# EAGLE design usbcan_20190426 (EAGLE 9.6.2)

## Sheet 1 of 2
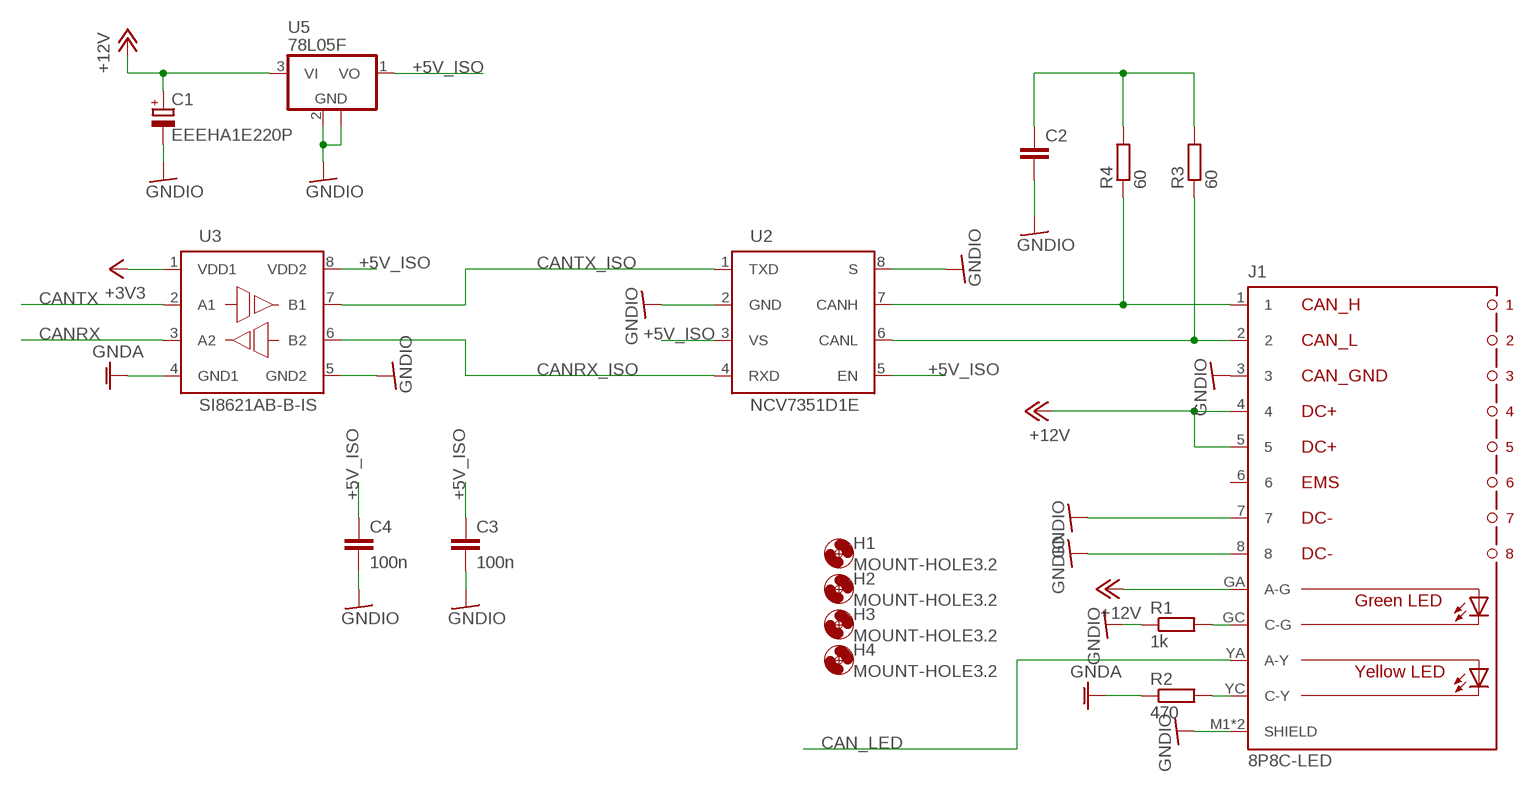
[diagram p0: schematic, sheet 1]

### Parts
C1  EEEHA1E220P  CPOL-EU153CLV-0605  [153CLV-0605]
C2  C-EUC0603  [C0603]
C3  100n  C-EUC0603  [C0603]
C4  100n  C-EUC0603  [C0603]
H1  MOUNT-HOLE3.2  [3,2]
H2  MOUNT-HOLE3.2  [3,2]
H3  MOUNT-HOLE3.2  [3,2]
H4  MOUNT-HOLE3.2  [3,2]
J1  8P8C-LED  [8P8C-LED]
R1  1k  R-EU_R0603  [R0603]
R2  470  R-EU_R0603  [R0603]
R3  60  R-EU_R0603  [R0603]
R4  60  R-EU_R0603  [R0603]
U2  NCV7351D1E  [SO08]
U3  SI8621AB-B-IS  [SO08]
U5  78L05F  [SOT89]

### Nets
+3V3: U3.1(VDD1) ; also sheet 2
+5V_ISO: C3.1 C4.1 U2.3(VS) U2.5(EN) U3.8(VDD2) U5.1(VO)
+12V: C1.+ J1.4 J1.5 J1.GA(A-G) U5.3(VI)
CAN_LED: J1.YA(A-Y) ; also sheet 2
CANH: J1.1 R4.1 U2.7(CANH)
CANL: J1.2 R3.1 U2.6(CANL)
CANRX: U3.3(A2) ; also sheet 2
CANRX_ISO: U2.4(RXD) U3.6(B2)
CANTX: U3.2(A1) ; also sheet 2
CANTX_ISO: U2.1(TXD) U3.7(B1)
GNDA: R2.1 U3.4(GND1) ; also sheet 2
GNDIO: C1.- C2.2 C3.2 C4.2 J1.3 J1.7 J1.8 J1.M1(SHIELD) J1.M2(SHIELD) R1.1 U2.2(GND) U2.8(S) U3.5(GND2) U5.2(GND) U5.2@1(GND)
N$3: J1.GC(C-G) R1.2
N$4: J1.YC(C-Y) R2.2
N$6: C2.1 R3.2 R4.2
Unconnected: J1.6

## Sheet 2 of 2
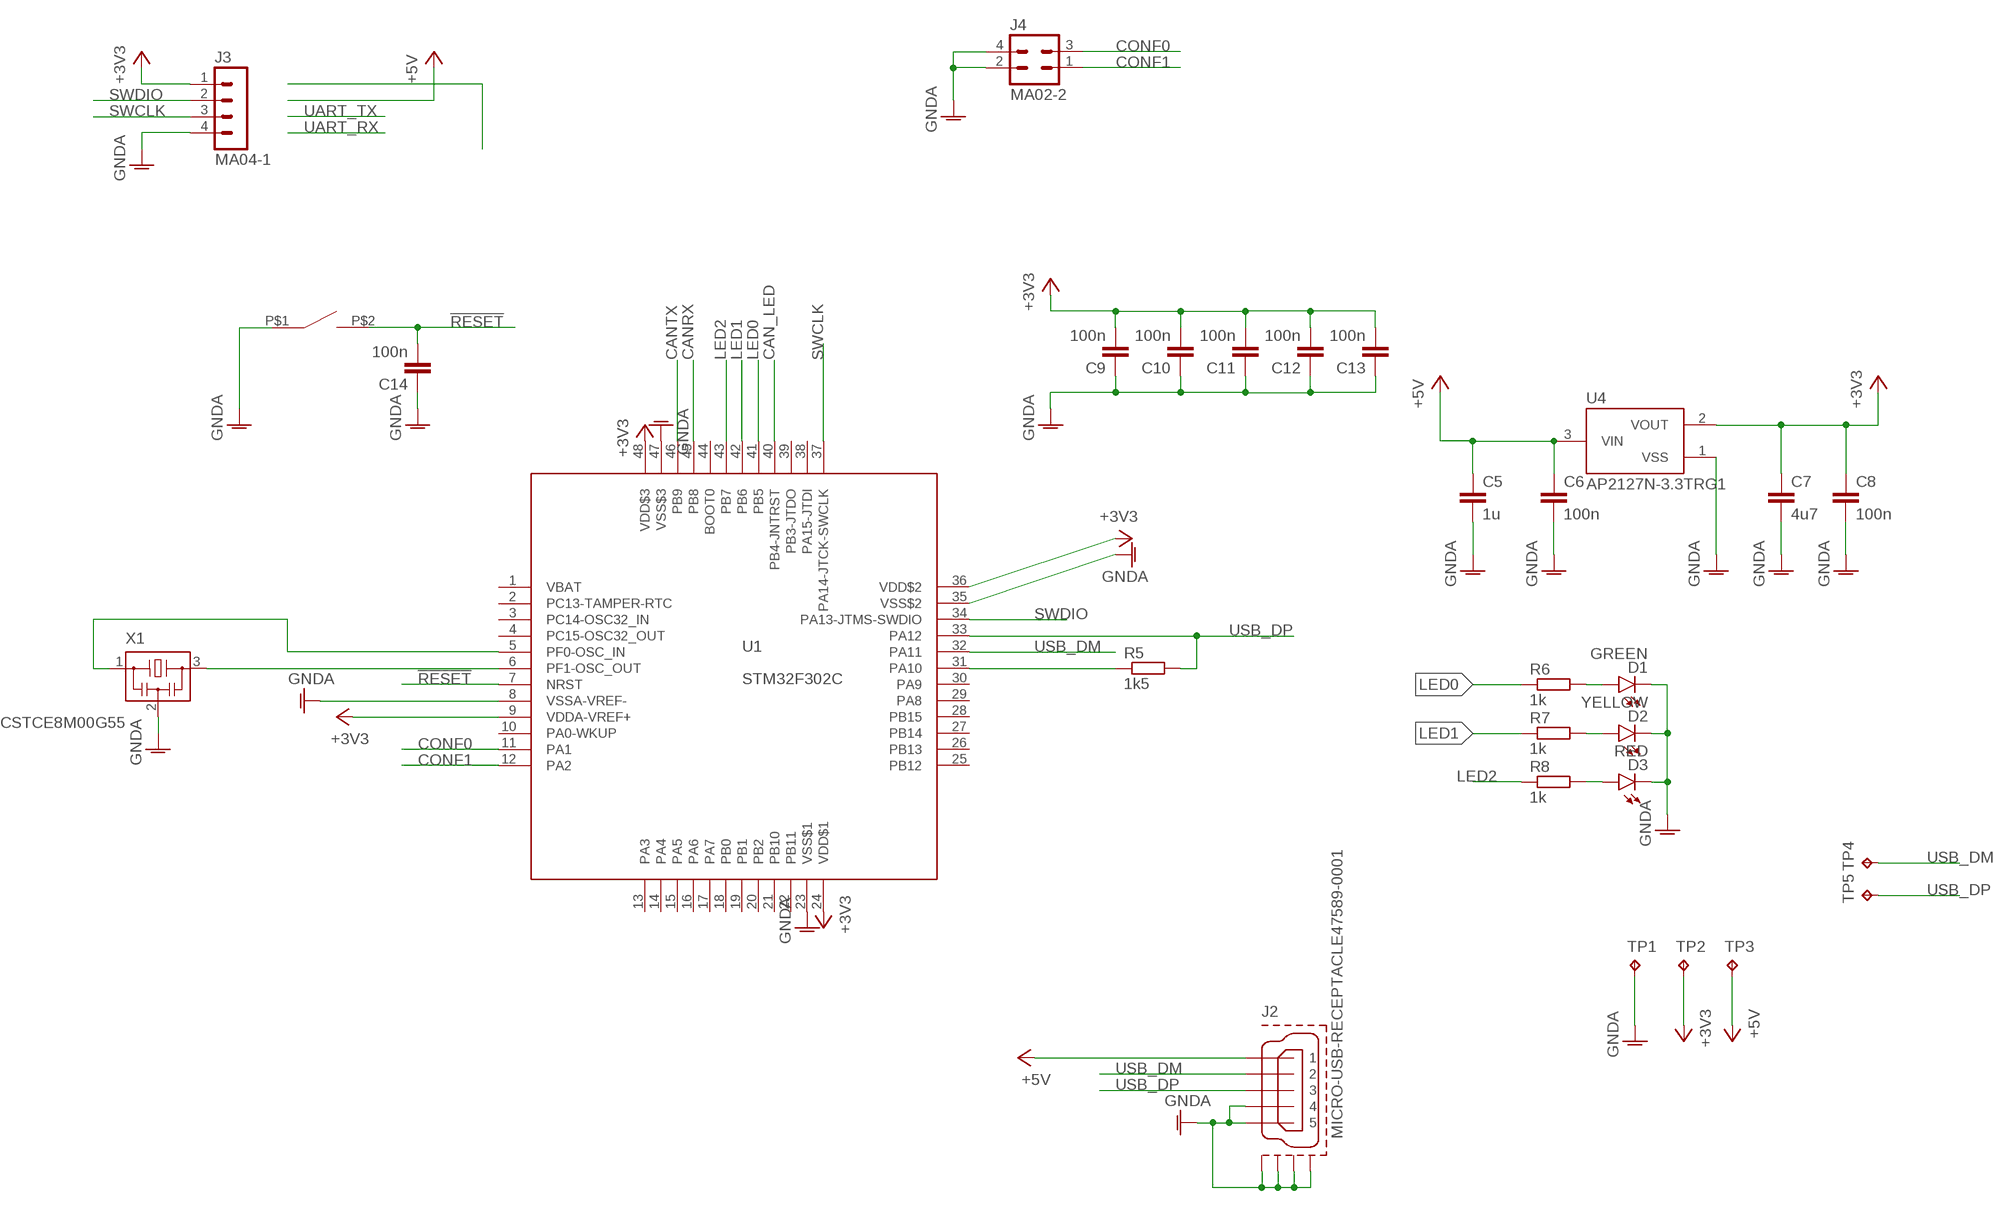
[diagram p1: schematic, sheet 2]

### Parts
C5  1u  C-EUC0603  [C0603]
C6  100n  C-EUC0603  [C0603]
C7  4u7  C-EUC0805  [C0805]
C8  100n  C-EUC0603  [C0603]
C9  100n  C-EUC0603  [C0603]
C10  100n  C-EUC0603  [C0603]
C11  100n  C-EUC0603  [C0603]
C12  100n  C-EUC0603  [C0603]
C13  100n  C-EUC0603  [C0603]
C14  100n  C-EUC0603  [C0603]
D1  GREEN  LEDCHIPLED_0805  [CHIPLED_0805]
D2  YELLOW  LEDCHIPLED_0805  [CHIPLED_0805]
D3  RED  LEDCHIPLED_0805  [CHIPLED_0805]
J2  MICRO-USB-RECEPTACLE47589-0001  [47589-0001]
J3  MA04-1  [MA04-1]
J4  MA02-2  [MA02-2W]
R5  1k5  R-EU_R0603  [R0603]
R6  1k  R-EU_R0603  [R0603]
R7  1k  R-EU_R0603  [R0603]
R8  1k  R-EU_R0603  [R0603]
S1  SWITCH_TACTILETOP  [SWITCH_TACTILE_3X6]
TP1  TPB1,27  [B1,27]
TP2  TPB1,27  [B1,27]
TP3  TPB1,27  [B1,27]
TP4  TPB1,27  [B1,27]
TP5  TPB1,27  [B1,27]
U1  STM32F302C  STM32F303C  [LQFP48]
U4  AP2127N-3.3TRG1  XC6206  [SOT95P240X110-3]
X1  CSTCE8M00G55  [CSTCE8M00G55]

### Nets
!RESET: C14.2 S1.P$2 U1.7(NRST)
+3V3: C7.1 C8.1 C9.2 C10.2 C11.2 C12.2 C13.2 J3.1 TP2.TP U1.9(VDDA-VREF+) U1.24(VDD$1) U1.36(VDD$2) U1.48(VDD$3) U4.2(VOUT) ; also sheet 1
+5V: C5.1 C6.1 J2.1 TP3.TP U4.3(VIN)
CAN_LED: U1.40(PB4-JNTRST) ; also sheet 1
CANRX: U1.45(PB8) ; also sheet 1
CANTX: U1.46(PB9) ; also sheet 1
CONF0: J4.3 U1.11(PA1)
CONF1: J4.1 U1.12(PA2)
GNDA: C5.2 C6.2 C7.2 C8.2 C9.1 C10.1 C11.1 C12.1 C13.1 C14.1 D1.C D2.C D3.C J2.4 J2.5 J2.CASING1(GND1) J2.CASING2(GND2) J2.CASING3(GND3) J2.CASING4(GND4) J2.P$1(GND1) J2.P$2(GND1) J2.P$3(GND2) J2.P$4(GND2) J3.4 J4.2 J4.4 S1.P$1 TP1.TP U1.8(VSSA-VREF-) U1.23(VSS$1) U1.35(VSS$2) U1.47(VSS$3) U4.1(VSS) X1.2 ; also sheet 1
LED0: R6.1 U1.41(PB5)
LED1: R7.1 U1.42(PB6)
LED2: R8.1 U1.43(PB7)
N$2: D2.A R7.2
N$5: D1.A R6.2
N$7: U1.6(PF1-OSC_OUT) X1.3
N$8: U1.5(PF0-OSC_IN) X1.1
N$11: R5.1 U1.31(PA10)
N$21: D3.A R8.2
SWCLK: J3.3 U1.37(PA14-JTCK-SWCLK)
SWDIO: J3.2 U1.34(PA13-JTMS-SWDIO)
USB_DM: J2.2 TP4.TP U1.32(PA11)
USB_DP: J2.3 R5.2 TP5.TP U1.33(PA12)
Unconnected: U1.1(VBAT) U1.2(PC13-TAMPER-RTC) U1.3(PC14-OSC32_IN) U1.4(PC15-OSC32_OUT) U1.10(PA0-WKUP) U1.13(PA3) U1.14(PA4) U1.15(PA5) U1.16(PA6) U1.17(PA7) U1.18(PB0) U1.19(PB1) U1.20(PB2) U1.21(PB10) U1.22(PB11) U1.25(PB12) U1.26(PB13) U1.27(PB14) U1.28(PB15) U1.29(PA8) U1.30(PA9) U1.38(PA15-JTDI) U1.39(PB3-JTDO) U1.44(BOOT0)

## Library data of the parts
C1 = rcl:CPOL-EU: POLARIZED CAPACITOR, European symbol; SPICEPREFIX: C
C2-C4 = rcl:C-EU: CAPACITOR, European symbol; SPICEPREFIX: C
C5-C14 = rcl:C-EU: CAPACITOR, European symbol
D1-D3 = led:LED: LED OSRAM: - CHIPLED LG R971, LG N971, LY N971, LG Q971, LY Q971, LO R971, LY R971 LH N974, LH R974 LS Q976, LO Q976, LY Q976 LO Q996 - Hyper CHIPLED LW Q18S LB Q993, LB Q99A, LB R99A - SideLED LS A670, LO A670, LY A670, LG A670, LP A670 LB A673, LV A673, LT A673, LW A673 LH A674 LY A675 LS A676, LA A676, LO A676, LY A676, LW A676 LS A679, LY A679, LG A679 - Hyper Micro SIDELED® LS Y876, LA Y876, LO Y876, LY Y876 LT Y87S - SmartLED LW L88C, LW L88S LB L89C, LB L89S, LG L890 LS L89K, LO L89K, LY L89K LS L896, LA L896, LO L896, LY L896 - TOPLED LS T670, LO T670, LY T670, LG T670, LP T670 LSG T670, LSP T670, LSY T670, LOP T670, LYG T670 LG T671, LOG T671, LSG T671 LB T673, LV T673, LT T673, LW T673 LH T674 LS T676, LA T676, LO T676, LY T676, LB T676, LH T676, LSB T676, LW T676 LB T67C, LV T67C, LT T67C, LS T67K, LO T67K, LY T67K, LW E67C LS E67B, LA E67B, LO E67B, LY E67B, LB E67C, LV E67C, LT E67C LW T67C LS T679, LY T679, LG T679 LS T770, LO T770, LY T770, LG T770, LP T770 LB T773, LV T773, LT T773, LW T773 LH T774 LS E675, LA E675, LY E675, LS T675 LS T776, LA T776, LO T776, LY T776, LB T776 LHGB T686 LT T68C, LB T68C - Hyper Mini TOPLED® LB M676 - Mini TOPLED Santana® LG M470 LS M47K, LO M47K, LY M47K Source: http://www.osram.convergy.de LUXEON: - LUMILED® LXK2-PW12-R00, LXK2-PW12-S00, LXK2-PW14-U00, LXK2-PW14-V00 LXK2-PM12-R00, LXK2-PM12-S00, LXK2-PM14-U00 LXK2-PE12-Q00, LXK2-PE12-R00, LXK2-PE12-S00, LXK2-PE14-T00, LXK2-PE14-U00 LXK2-PB12-K00, LXK2-PB12-L00, LXK2-PB12-M00, LXK2-PB14-N00, LXK2-PB14-P00, LXK2-PB14-Q00 LXK2-PR12-L00, LXK2-PR12-M00, LXK2-PR14-Q00, LXK2-PR14-R00 LXK2-PD12-Q00, LXK2-PD12-R00, LXK2-PD12-S00 LXK2-PH12-R00, LXK2-PH12-S00 LXK2-PL12-P00, LXK2-PL12-Q00, LXK2-PL12-R00 Source: www.luxeon.com KINGBRIGHT: KA-3528ASYC Source: www.kingbright.com
H1-H4 = holes:MOUNT-HOLE: MOUNTING HOLE with drill center marker
J1 = con-rj45:8P8C-LED: generic 8P8C connector with two LED's; OC_FARNELL: unknown; OC_NEWARK: unknown
J2 = con-molex-usb:MICRO-USB-RECEPTACLE: MICRO USB RECEPTACLES Micro-USB Receptacles, SMT, Lead-Free from MOLEX <http://www.molex.com/>. (C) 2014 Tomasz Boleslaw CEDRO, cederom@tlen.pl, http://www.tomek.cedro.info. Version 0.1 (2014-01-17): Initial release. Version 0.2 (2014-02-06): Updated 47589-0001 footprint pins/pads/milling. Following devices are included: 1. 47589-0001 Micro-USB AB Receptacle, Bottom Mount, SMT, Lead-Free <http://www.molex.com/molex/products/datasheet.jsp?part=active/0475890001_IO_CONNECTORS.xml> (Technical Drawing <http://www.molex.com/pdm_docs/sd/475890001_sd.pdf>).
J3 = con-headers:MA04-1
J4 = con-headers:MA02-2
R1-R4 = rcl:R-EU_: RESISTOR, European symbol; SPICEPREFIX: R
R5-R8 = rcl:R-EU_: RESISTOR, European symbol
S1 = switch-tactile:SWITCH_TACTILE
TP1-TP5 = testpad:TP: Test pad
U1 = stm32_mcu:STM32F303C*
U2 = on-semi:NCV7351D1E: High Speed CAN Transceiver Source: NCV7351-D.PDF <http://www.onsemi.com/PowerSolutions/document/NCV7351-D.PDF>
U3 = silabs:SI8621AB-B-IS: 1 Mbps Digital Isolator 1 Mbps, 2.5 kVRMS Digital Isolator Source: Si86xx.pdf <https://www.silabs.com/documents/public/data-sheets/Si86xx.pdf>
U4 = torex:XC6206
U5 = linear:78L*: POSITOIV-VOLTAGE REGULATORS Output up to 100 mA Source: Datasheet <http://focus.ti.com/lit/ds/symlink/ua78l05.pdf>
X1 = resonator:CSTCE8M00G55

## Board
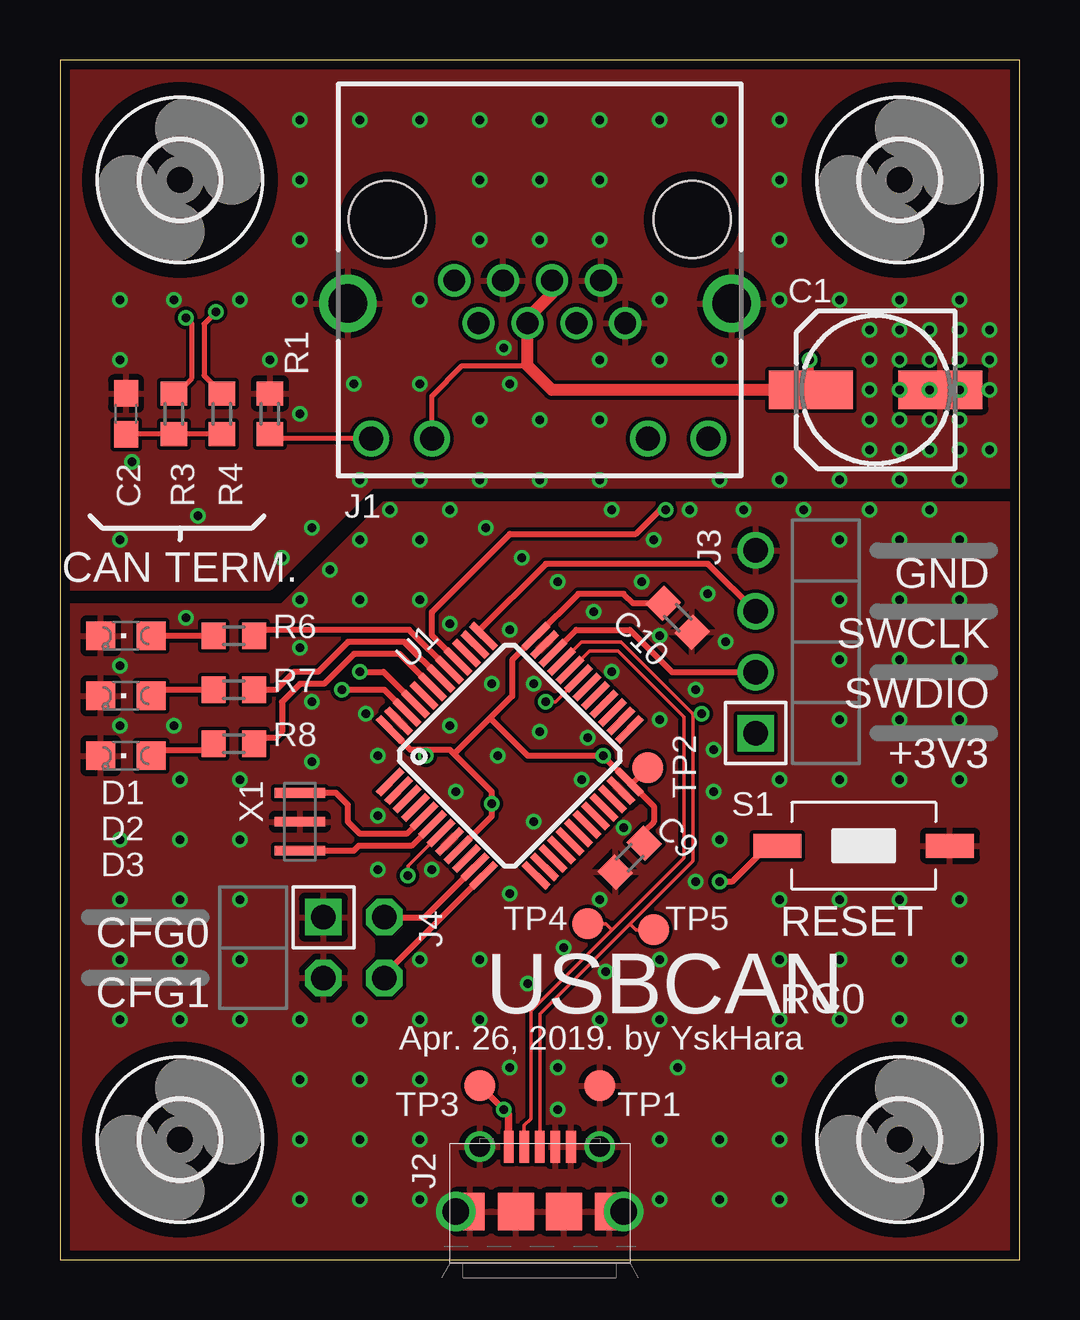
[diagram p2: board, top side]
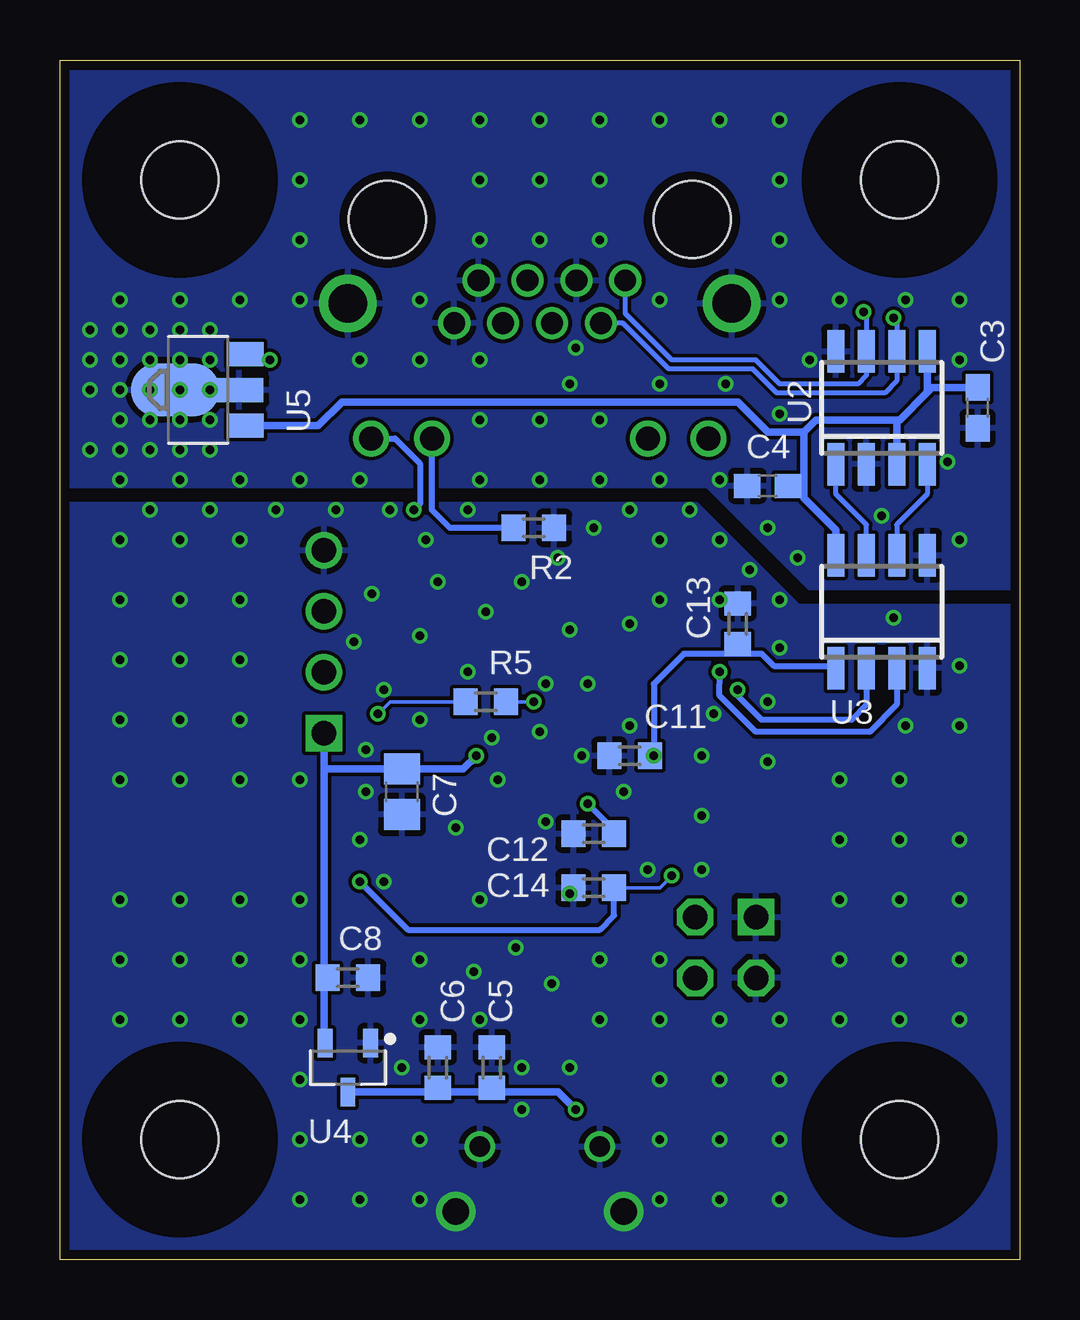
[diagram p3: board, bottom side, seen from below]

Size 40 x 50 mm. Coordinates in mm from the lower left corner, seen from the top.
Outline: 0,0 40,0 40,50 0,50 0,0
Copper layers (1*16): Top 0.035mm / dielectric 1.5mm / Bottom 0.035mm
Design rules "seeed_2layers": minimum track width 6mil, minimum drill 0.2mm, track to track 6mil, track to pad 6mil, pad to pad 6mil, via to via 6mil, smd to smd 0mil, copper to edge 0.4mm, drill to drill 12mil, minimum pad ring 0.15mm, minimum via ring 0.15mm, stop-mask expansion 4mil, vias tented up to drill 50mil, thermal gap 10mil
tKeepout: 12 lines
bKeepout: 12 lines
tRestrict: 2 lines
bRestrict: 1 lines

### Footprints (pad centres in the part's own frame; a part is rotated, then mirrored left to right if it is on the bottom)
153CLV-0605 = smd 3.5 x 1.6: + 2.7,0; - -2.7,0
C0603 = smd 1.1 x 1: 1 -0.85,0; 2 0.85,0
C0603' = smd 1 x 1.1: 1 -0.85,0; 2 0.85,0
C0805 = smd 1.3 x 1.5: 1 -0.95,0; 2 0.95,0
CHIPLED_0805 = smd 1.2 x 1.2: A 0,-1.05; C 0,1.05
3,2 = hole 3.2: 0,0
8P8C-LED = drill 0.9 pad 1.3: 1 3.57,-3.81; 2 2.55,-2.03; 3 1.53,-3.81; 4 0.51,-2.03; 5 -0.51,-3.81; 6 -1.53,-2.03; 7 -2.55,-3.81; 8 -3.57,-2.03 | drill 1 pad 1.422: GA 4.5,2.78; GC 7.04,2.78; YA -7.04,2.78; YC -4.5,2.78 | drill 1.6 pad 2.184: M1 -8,-2.85; M2 8,-2.85 | hole 3.2: 6.35,-6.35; -6.35,-6.35
47589-0001 = smd 1.35 x 0.4: 1 2.7,1.3; 2 2.7,0.65; 3 2.7,0; 4 2.7,-0.65; 5 2.7,-1.3 | drill 1.1 pad 1.6: CASING1 0,3.5; CASING2 0,-3.5 | drill 0.85 pad 1.25: CASING3 2.7,2.5; CASING4 2.7,-2.5 | smd 1.55 x 1.2: P$1 0,2.9; P$4 0,-2.9 | smd 1.55 x 1.5: P$2 0,1; P$3 0,-1
MA04-1 = drill 1.016 square: 1 3.81,0 | drill 1.016: 2 1.27,0; 3 -1.27,0; 4 -3.81,0
MA02-2W = drill 1.016 octagon: 1 -1.27,-1.27; 2 -1.27,1.27; 3 1.27,-1.27 | drill 1.016 square: 4 1.27,1.27
R0603 = smd 1 x 1.1: 1 -0.85,0; 2 0.85,0
SWITCH_TACTILE_3X6 = smd 2 x 1: P$1 -3.6,0; P$2 3.6,0
B1,27 = smd 1.27 x 1.27: TP 0,0
LQFP48 = smd 1.4 x 0.3: 1 -4.3,2.75; 2 -4.3,2.25; 3 -4.3,1.75; 4 -4.3,1.25; 5 -4.3,0.75; 6 -4.3,0.25; 7 -4.3,-0.25; 8 -4.3,-0.75; 9 -4.3,-1.25; 10 -4.3,-1.75; 11 -4.3,-2.25; 12 -4.3,-2.75; 25 4.3,-2.75; 26 4.3,-2.25; 27 4.3,-1.75; 28 4.3,-1.25; 29 4.3,-0.75; 30 4.3,-0.25; 31 4.3,0.25; 32 4.3,0.75; 33 4.3,1.25; 34 4.3,1.75; 35 4.3,2.25; 36 4.3,2.75 | smd 0.3 x 1.4: 13 -2.75,-4.3; 14 -2.25,-4.3; 15 -1.75,-4.3; 16 -1.25,-4.3; 17 -0.75,-4.3; 18 -0.25,-4.3; 19 0.25,-4.3; 20 0.75,-4.3; 21 1.25,-4.3; 22 1.75,-4.3; 23 2.25,-4.3; 24 2.75,-4.3; 37 2.75,4.3; 38 2.25,4.3; 39 1.75,4.3; 40 1.25,4.3; 41 0.75,4.3; 42 0.25,4.3; 43 -0.25,4.3; 44 -0.75,4.3; 45 -1.25,4.3; 46 -1.75,4.3; 47 -2.25,4.3; 48 -2.75,4.3
SO08 = smd 0.72 x 1.78: 1 -1.905,-2.35; 2 -0.635,-2.35; 3 0.635,-2.35; 4 1.905,-2.35; 5 1.905,2.35; 6 0.635,2.35; 7 -0.635,2.35; 8 -1.905,2.35
SOT95P240X110-3 = smd 1.18 x 0.609: 1 -1.024,0.95; 2 -1.024,-0.95; 3 1.024,0
SOT89 = smd 1 x 1.5: 1 -1.499,-1.981; 3 1.499,-1.981 | smd 1 x 2: 2 0,-1.727 | smd 2.2 x 3.7: 2@1 0,0.94
CSTCE8M00G55 = smd 0.4 x 2.1: 1 -1.2,0; 2 0,0; 3 1.2,0

### Placement (x,y rotation side)
C1  34,36.25 180 top
C2  2.75,35.25 90 top
C3  1.75,35.5 270 bottom
C4  10.5,32.25 180 bottom
C5  1u  [C0603']  22,8 90 bottom
C6  100n  [C0603']  24.25,8 90 bottom
C7  25.75,19.5 270 bottom
C8  100n  [C0603']  28,11.75 0 bottom
C9  100n  [C0603']  23.75,16.75 45 top
C10  100n  [C0603']  25.75,26.75 135 top
C11  100n  [C0603']  16.25,21 0 bottom
C12  100n  [C0603']  17.75,17.75 0 bottom
C13  100n  [C0603']  11.75,26.5 270 bottom
C14  100n  [C0603']  17.75,15.5 0 bottom
D1  2.75,26 90 top
D2  2.75,23.5 90 top
D3  2.75,21 90 top
H1  5,5 0 top
H2  35,5 0 top
H3  5,45 0 top
H4  35,45 0 top
J1  20,37 180 top
J2  20,2 90 top
J3  29,25.75 270 top
J4  12.25,13 90 top
R1  8.75,35.25 270 top
R2  20.25,30.5 180 bottom
R3  4.75,35.25 270 top
R4  6.75,35.25 270 top
R5  22.25,23.25 180 bottom
R6  7.25,26 180 top
R7  7.25,23.75 180 top
R8  7.25,21.5 180 top
S1  33.5,17.25 180 top
TP1  22.5,7.25 0 top
TP2  24.5,20.5 0 top
TP3  17.5,7.25 0 top
TP4  22,14 0 top
TP5  24.75,13.75 0 top
U1  18.75,21 45 top
U2  5.75,35.5 0 bottom
U3  5.75,27 0 bottom
U4  28,8 270 bottom
U5  34.25,36.25 90 bottom
X1  10,18.25 270 top

### Tracks (layer width: path | path; a pad name or v marks a point on that pad's centre or on a via)
!RESET  (via drill 0.35)
  Top 0.152: v14.5,16 14.5,16.4 U1.7
  Top 0.254: S1.P$2 29.5,17.25 28,15.75 v27.5,15.75
  Bottom 0.152: C14.2 15,15.5 v14.5,16
  Bottom 0.254: v27.5,15.75 25.5,13.75 17.5,13.75 16.9,14.35 C14.2
+3V3  (via drill 0.35)
  Top 0.152: 23.9,19.9 U1.24
  Top 0.254: C10.2 23.9,27.35 23.5,27.75 21.61,27.75 U1.36 18.85,24.98 18.85,23.48 17.93,22.57 | 17.93,22.57 16.43,21.07 | U1.48 14.61,21.25 15,21.25 | 15.11,21.25 16.25,21.25 16.43,21.07 | 15.11,21.25 15,21.25 | U1.9 18,18.48 v18,19 18,19.5 16.43,21.07 | 17.93,22.57 19.5,21 v22.64,21 U1.24 24.75,18.89 24.75,18.25 24.35,17.85 C9.2 | 15.11,21.25 15.11,21.14 v15.25,21 15,21.25 | TP2.TP 23.9,19.9
  Bottom 0.254: C12.2 16.9,17.9 v18,19 | 11.75,25.25 10.75,25.25 10.25,24.75 7.75,24.75 U3.1 | 11.75,25.25 14,25.25 15.25,24 v15.25,21 | C13.2 11.75,25.25
  Bottom 0.305: v22.64,21 23.19,20.45 C7.1 29,20.45 | 29,20.45 J3.1 | 29,20.45 29,11.75 | U4.2 29,9.02 29,11.75 | C8.1 29,11.75 | C11.2 v15.25,21
+5V  (via drill 0.35)
  Top 0.254: TP3.TP v18.5,6.25
  Top 0.305: J2.1 18.7,6.05 v18.5,6.25
  Bottom 0.305: v18.5,6.25 19.25,7 22,7 | 22,7 24.25,7 | C5.1 22,7 | C6.1 24.25,7 | U4.3 28,7 24.25,7
+5V_ISO
  Bottom 0.305: U2.5 3.85,36.16 | 5.12,35 U2.3 | 3.85,36.16 5,35 5.12,35 | U3.8 7.66,30.41 9,31.75 9,32.25 | 9,34.5 10.5,34.5 11.75,35.75 28.25,35.75 29.25,34.75 U5.1 | 9,32.25 9,34.5 | 9,34.5 8.5,35 5.12,35 | C4.1 9,32.25 | C3.1 3.65,36.35 3.85,36.16
+12V  (via drill 0.35)
  Top 0.2: J1.GA 15.5,36 16.76,37.26 19.49,37.26
  Top 0.305: v31.25,37.5 31.25,36.3 C1.+
  Top 0.508: C1.+ 20.5,36.25 19.49,37.26 J1.4 19.49,39.24 20.51,40.26 J1.5
  Bottom 0.305: U5.3 32.02,37.5 v31.25,37.5
CAN_LED  (via drill 0.35)
  Top 0.254: U1.40 15.5,26.02 15.5,27 18.75,30.25 24,30.25 25,31.25 v25.25,31.25
  Bottom 0.254: J1.YA 26.04,34.22 25,33.18 25,31.5 v25.25,31.25
CANH  (via drill 0.35)
  Top 0.2: v6.5,39.5 6,39 6,36.85 R4.1
  Bottom 0.2: J1.1 16.43,39.43 14.5,37.5 11,37.5 10,36.5 6.75,36.5 6.38,36.87 U2.7 6.38,39.38 v6.5,39.5
CANL  (via drill 0.35)
  Top 0.2: R3.1 4.85,36.1 5.5,36.75 5.5,39 v5.25,39.25
  Bottom 0.2: J1.2 16.53,39.03 14.62,37.12 11.12,37.12 10.12,36.12 5.62,36.12 5.12,36.63 U2.6 5.12,39.12 v5.25,39.25
CANRX  (via drill 0.35)
  Top 0.254: v12.5,24.5 13.48,24.5 U1.45
  Bottom 0.254: U3.3 5.12,23.14 6.25,22 11,22 12.5,23.5 v12.5,24.5
CANRX_ISO
  Bottom 0.2: U2.4 3.85,31.91 5.12,30.64 U3.6
CANTX  (via drill 0.35)
  Top 0.254: v11.75,23.75 13.53,23.75 U1.46
  Bottom 0.254: U3.2 6.38,23.11 7,22.5 10.75,22.5 11.75,23.5 v11.75,23.75
CANTX_ISO
  Bottom 0.2: U3.7 6.38,30.64 7.66,31.91 U2.1
CONF0
  Top 0.254: J4.3 15.2,14.27 U1.11
CONF1
  Top 0.254: J4.1 13.5,11.75 13.5,11.86 U1.12
GNDA  (via drill 0.35)
  other vias: 23,24.5 22.25,27 27.75,25.75 23.5,18 15.5,16.25 10,25.5 12.75,22.75 5,17.5 2.5,17.5 2.5,15 5,15 7.5,20 7.5,17.5 13.25,18.5 7.5,15 15,30 19.25,29.25 20.75,28.25 16.25,26.5 12.5,30 10,27.5 15,12.5 17.5,12.5 25,12.5 22.5,15 18.75,15.25 18.25,21 20,22 13.25,16.25 30,15 32.5,15 35,15 37.5,15 37.5,20 35,20 32.5,20 30,20 27.5,17.5 26.5,23.75 25,22.5 24.75,30 26.25,31.25 32.5,30 32.5,27.5 32.5,25 32.5,22.5 35,22.5 37.5,22.5 37.5,25 35,25 35,27.5 37.5,27.5 37.5,30 35,30 30,12.5 32.5,12.5 35,12.5 37.5,12.5 37.5,10 35,10 32.5,10 30,10 30,7.5 30,5 27.5,5 27.5,2.5 30,2.5 25,2.5 25,5 15,7.5 15,5 15,2.5 12.5,2.5 12.5,5 12.5,7.5 10,7.5 10,5 10,2.5 10,10 12.5,10 15,10 17.5,10 7.5,10 5,10 2.5,10 2.5,12.5 5,12.5 7.5,12.5 24.25,28.25 23,31.25 18.75,26.25 16.25,22.25 18,24 16.5,19.5 10.5,20.75 10.5,23.25 4.75,22.25 2.5,24.75 5.25,26.75 2.5,22.25 13.25,21 26.5,15.75 25,10 22.5,10 22.75,12 20.75,6.25 20.75,8 18.75,8 19.5,11.5 21,13 27.25,19.5 27.25,21.25 22,21.75 21.75,20 19.75,18.25 16.25,31.25 17.75,30.5 13.75,31.25 11.25,28.75 15,27.5 33.75,31.25 36.25,31.25 31,31.25 28.5,31.25 25,26 27,27.75 12.5,27.5 19.75,24 5,20 25.75,8
  pour Bottom (rank 6): 0.25,27.25 0.25,0.25 39.75,0.25 39.75,31.5 13.5,31.5 9.25,27.25
  pour Top (rank 6): 0.25,27.25 0.25,0.25 39.75,0.25 39.75,31.5 13.5,31.5 9.25,27.25
GNDIO  (via drill 0.35)
  other vias: 10,42.5 10,40 7.5,40 2.5,40 4.75,40 2.5,37.5 3,33.25 2.5,30 10.5,30.5 12.5,32.5 15,32.5 17.5,32.5 20,32.5 22.5,32.5 20,35 17.5,35 22.5,35 27.5,32.5 30,32.5 32.5,32.5 35,32.5 37.5,32.5 37.5,40 35,40 32.5,40 30,40 30,42.5 30,45 30,47.5 27.5,47.5 25,47.5 22.5,47.5 22.5,45 22.5,42.5 25,40 25,37.5 27.5,37.5 22.5,37.5 20,42.5 20,45 20,47.5 17.5,47.5 17.5,45 17.5,42.5 15,47.5 12.5,47.5 10,47.5 10,45 15,40 18.75,36.5 15,36.5 12.25,36.5 10,35.25 18.5,38 8.75,37.5 5.75,31 9.25,29.25 33.75,33.75 36.25,33.75 38.75,33.75 37.5,35 37.5,37.5 38.75,38.75 36.25,38.75 35,37.5 33.75,36.25 36.25,36.25 33.75,38.75 33.75,35 36.25,35 35,35 35,36.25 37.5,36.25 38.75,36.25 38.75,37.5 36.25,37.5 37.5,38.75 35,38.75 33.75,37.5 35,33.75 37.5,33.75
  pour Top: 0.25,49.75 0.25,28 8.75,28 13,32.25 39.75,32.25 39.75,49.75
  pour Bottom: 0.25,49.75 0.25,28 8.75,28 13,32.25 39.75,32.25 39.75,49.75
LED0
  Top 0.254: U1.41 14.56,26.25 8.35,26.25 R6.1
LED1
  Top 0.254: U1.42 14.35,25.75 12,25.75 10.75,24.5 9.75,24.5 9,23.75 R7.1
LED2
  Top 0.254: U1.43 14.15,25.25 12.25,25.25 11,24 10,24 9.25,23.25 9.25,22 9,21.75 8.35,21.75 R8.1
N$2
  Top 0.254: R7.2 4.05,23.75 D2.A
N$3
  Top 0.2: J1.GC 8.93,34.22 R1.2
N$4
  Bottom 0.254: R2.2 23.75,30.5 24.5,31.25 J1.YC
N$5
  Top 0.254: R6.2 D1.A
N$6
  Top 0.2: R4.2 R3.2 C2.1
N$7
  Top 0.254: U1.6 14.65,17.25 12.45,17.25 12.25,17.05 X1.3
N$8
  Top 0.254: U1.5 14.44,17.75 12.5,17.75 12,18.25 12,18.95 11.5,19.45 X1.1
N$11  (via drill 0.35)
  Top 0.152: U1.31 20.65,23.25 v20.25,23.25
  Bottom 0.152: v20.25,23.25 R5.1
N$21
  Top 0.254: D3.A 4.05,21.25 6.15,21.25 R8.2
SWCLK
  Top 0.254: 17.45,26.2 | 17.45,26.2 U1.37 | 17.45,26.2 20.25,29 27.02,29 J3.3
SWDIO
  Top 0.254: U1.34 21.52,26.25 23.75,26.25 25.52,24.48 J3.2
USB_DM
  Top 0.152: U1.32 22.06,25.38 23.25,25.38 26,22.62 26,16.75 23,13.75 | J2.2 19.35,5.6 19.62,5.88 19.62,10.38 23,13.75 | TP4.TP 22.75,14 23,13.75
USB_DP  (via drill 0.35)
  Top 0.152: U1.33 21.73,25.75 23.38,25.75 26.38,22.75 | 26.38,22.75 26.38,16.62 23.75,14 | 23.75,14 20,10.25 J2.3 | 26.38,22.75 v26.75,22.75 | TP5.TP 24,13.75 23.75,14
  Bottom 0.152: R5.2 26.25,23.25 v26.75,22.75

### Text on the board
tPlace: CAN TERM. | GND | SWCLK | SWDIO | +3V3 | RESET | CFG0 | CFG1 | USBCAN | RC0 | Apr. 26, 2019. by YskHara